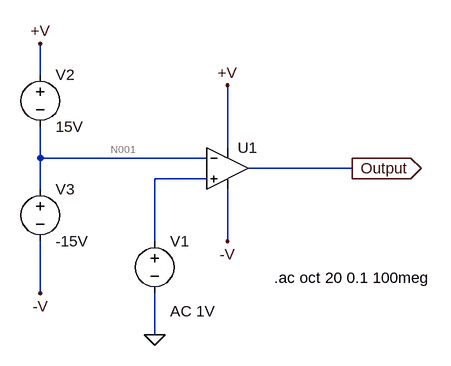
[diagram p0: schematic 25.1_5.(1).asc]
25.1_5.(1).asc, the LTspice schematic file:
Version 4
SHEET 1 880 680
WIRE -64 48 -64 0
WIRE 224 160 224 64
WIRE -64 176 -64 128
WIRE 192 176 -64 176
WIRE 416 192 256 192
WIRE 192 208 112 208
WIRE -64 224 -64 176
WIRE 112 304 112 208
WIRE 224 304 224 224
WIRE -64 384 -64 304
WIRE 112 448 112 384
FLAG 416 192 Output
IOPIN 416 192 Out
FLAG 112 448 0
FLAG -64 0 +V
FLAG 224 64 +V
FLAG -64 384 -V
FLAG 224 304 -V
SYMBOL Opamps\\UniversalOpamp2 224 192 R0
SYMATTR InstName U1
SYMBOL voltage -64 32 R0
WINDOW 123 0 0 Left 2
WINDOW 39 0 0 Left 2
SYMATTR InstName V2
SYMATTR Value 15V
SYMBOL voltage -64 208 R0
WINDOW 123 0 0 Left 2
WINDOW 39 0 0 Left 2
SYMATTR InstName V3
SYMATTR Value -15V
SYMBOL voltage 112 288 R0
WINDOW 123 24 124 Left 2
WINDOW 39 0 0 Left 2
SYMATTR InstName V1
SYMATTR Value ""
SYMATTR Value2 AC 1V
TEXT 296 360 Left 2 !.ac oct 20 0.1 100meg

The netlist it stands for:
* 25.1_5.(1).asc
XU1 N002 N001 +V -V Output level.2 Avol=1Meg GBW=10Meg Slew=10Meg ilimit=25m rail=0 Vos=0 phimargin=45 en=0 enk=0 in=0 ink=0 Rin=500Meg  ; pins IN+ IN- V+ V- OUT
V2 +V N001 15V
V3 N001 -V -15V
V1 N002 0 AC 1V
.ac oct 20 0.1 100meg
.lib UniversalOpamps2.sub
.backanno
.end

* Results of the author's LTspice run, read from the files saved beside the schematic
* Operating Point, zero values left out:
*   V(output) = 14.89 V
*   V(+v) = 14.89 V
*   V(-v) = 14.89 V
*   V(n001) = -109.2 mV
*   I(V1) = 29.78 nA
*   I(V3) = 15 nA
*   I(V2) = -15 nA
*   Ix(u1:1) = -29.78 nA
*   Ix(u1:2) = -30 nA
*   Ix(u1:3) = 15 nA
*   Ix(u1:4) = 15 nA
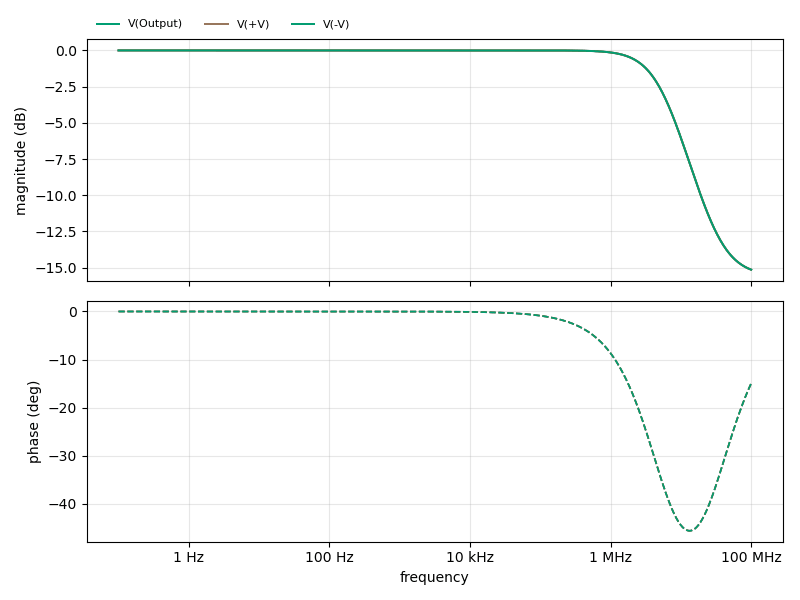
[diagram p1: AC Analysis of 25.1_5.(1).asc, plotted from the saved traces]
* AC Analysis, 1 run:
*   V(Output): -0.00 dB at 100 mHz, -15.14 dB at 100 MHz, peak -0.00 dB at 2.599 Hz, 3 dB below the peak at 5.587 MHz
*   V(+V): -0.00 dB at 100 mHz, -15.14 dB at 100 MHz, peak -0.00 dB at 2.599 Hz, 3 dB below the peak at 5.587 MHz
*   V(-V): -0.00 dB at 100 mHz, -15.14 dB at 100 MHz, peak -0.00 dB at 2.599 Hz, 3 dB below the peak at 5.587 MHz